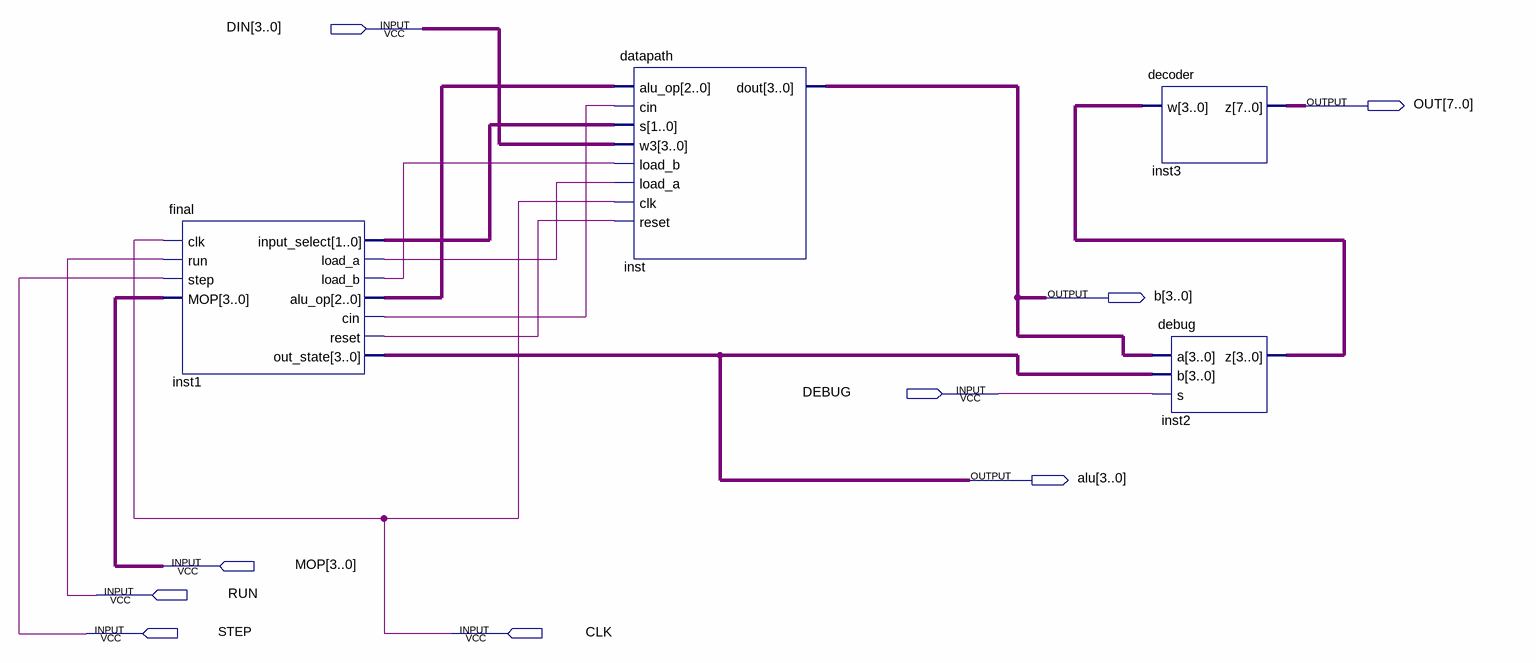
[diagram p0: schematic sheet]
// Quartus schematic calculator.bdf as structural Verilog: 4 symbols, 9 pins
module calculator (
  input  [3:0] DIN,
  input  DEBUG,
  input  [3:0] MOP,
  input  RUN,
  input  STEP,
  input  CLK,
  output [7:0] OUT,
  output [3:0] b,
  output [3:0] alu
);

  wire inst1_cin, inst1_load_a, inst1_load_b, inst1_reset;
  wire [1:0] inst1_input_select;
  wire [2:0] inst1_alu_op;
  wire [3:0] inst2_z;

  \final  inst1 (
    .clk(CLK), .run(RUN), .step(STEP), .MOP(MOP), .input_select(inst1_input_select), .load_a(inst1_load_a),
    .load_b(inst1_load_b), .alu_op(inst1_alu_op), .cin(inst1_cin), .reset(inst1_reset), .out_state(alu));
  datapath inst (
    .alu_op(inst1_alu_op), .cin(inst1_cin), .s(inst1_input_select), .w3(DIN), .load_b(inst1_load_b),
    .load_a(inst1_load_a), .clk(CLK), .reset(inst1_reset), .dout(b));
  decoder inst3 (.w(inst2_z), .z(OUT));
  debug inst2 (.a(b), .b(alu), .s(DEBUG), .z(inst2_z));
endmodule
